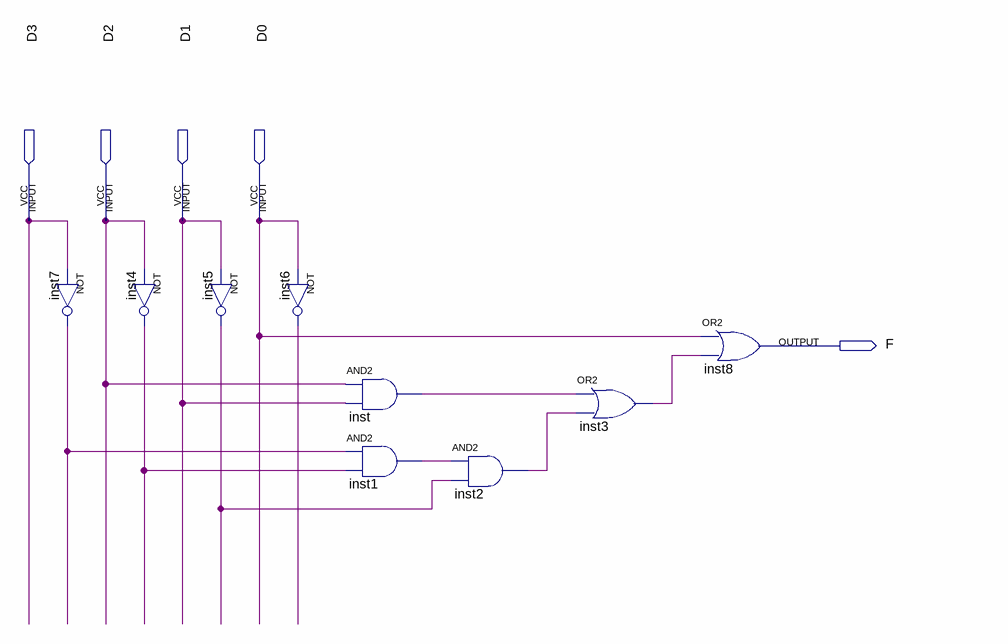
[diagram p0: schematic sheet]
// Quartus schematic ex1-5.bdf as structural Verilog: 9 symbols, 5 pins
module \ex1-5  (
  input  D3,
  input  D2,
  input  D1,
  input  D0,
  output F
);

  wire inst1_out, inst2_out, inst3_out, inst4_out, inst5_out, inst6_out, inst7_out, inst_out;

  not inst7 (inst7_out, D3);
  not inst4 (inst4_out, D2);
  not inst5 (inst5_out, D1);
  not inst6 (inst6_out, D0);
  and inst (inst_out, D2, D1);
  and inst1 (inst1_out, inst7_out, inst4_out);
  and inst2 (inst2_out, inst1_out, inst5_out);
  or inst3 (inst3_out, inst_out, inst2_out);
  or inst8 (F, D0, inst3_out);
endmodule
